# EAGLE design Motor Driver MK1 (EAGLE 6.5.0)
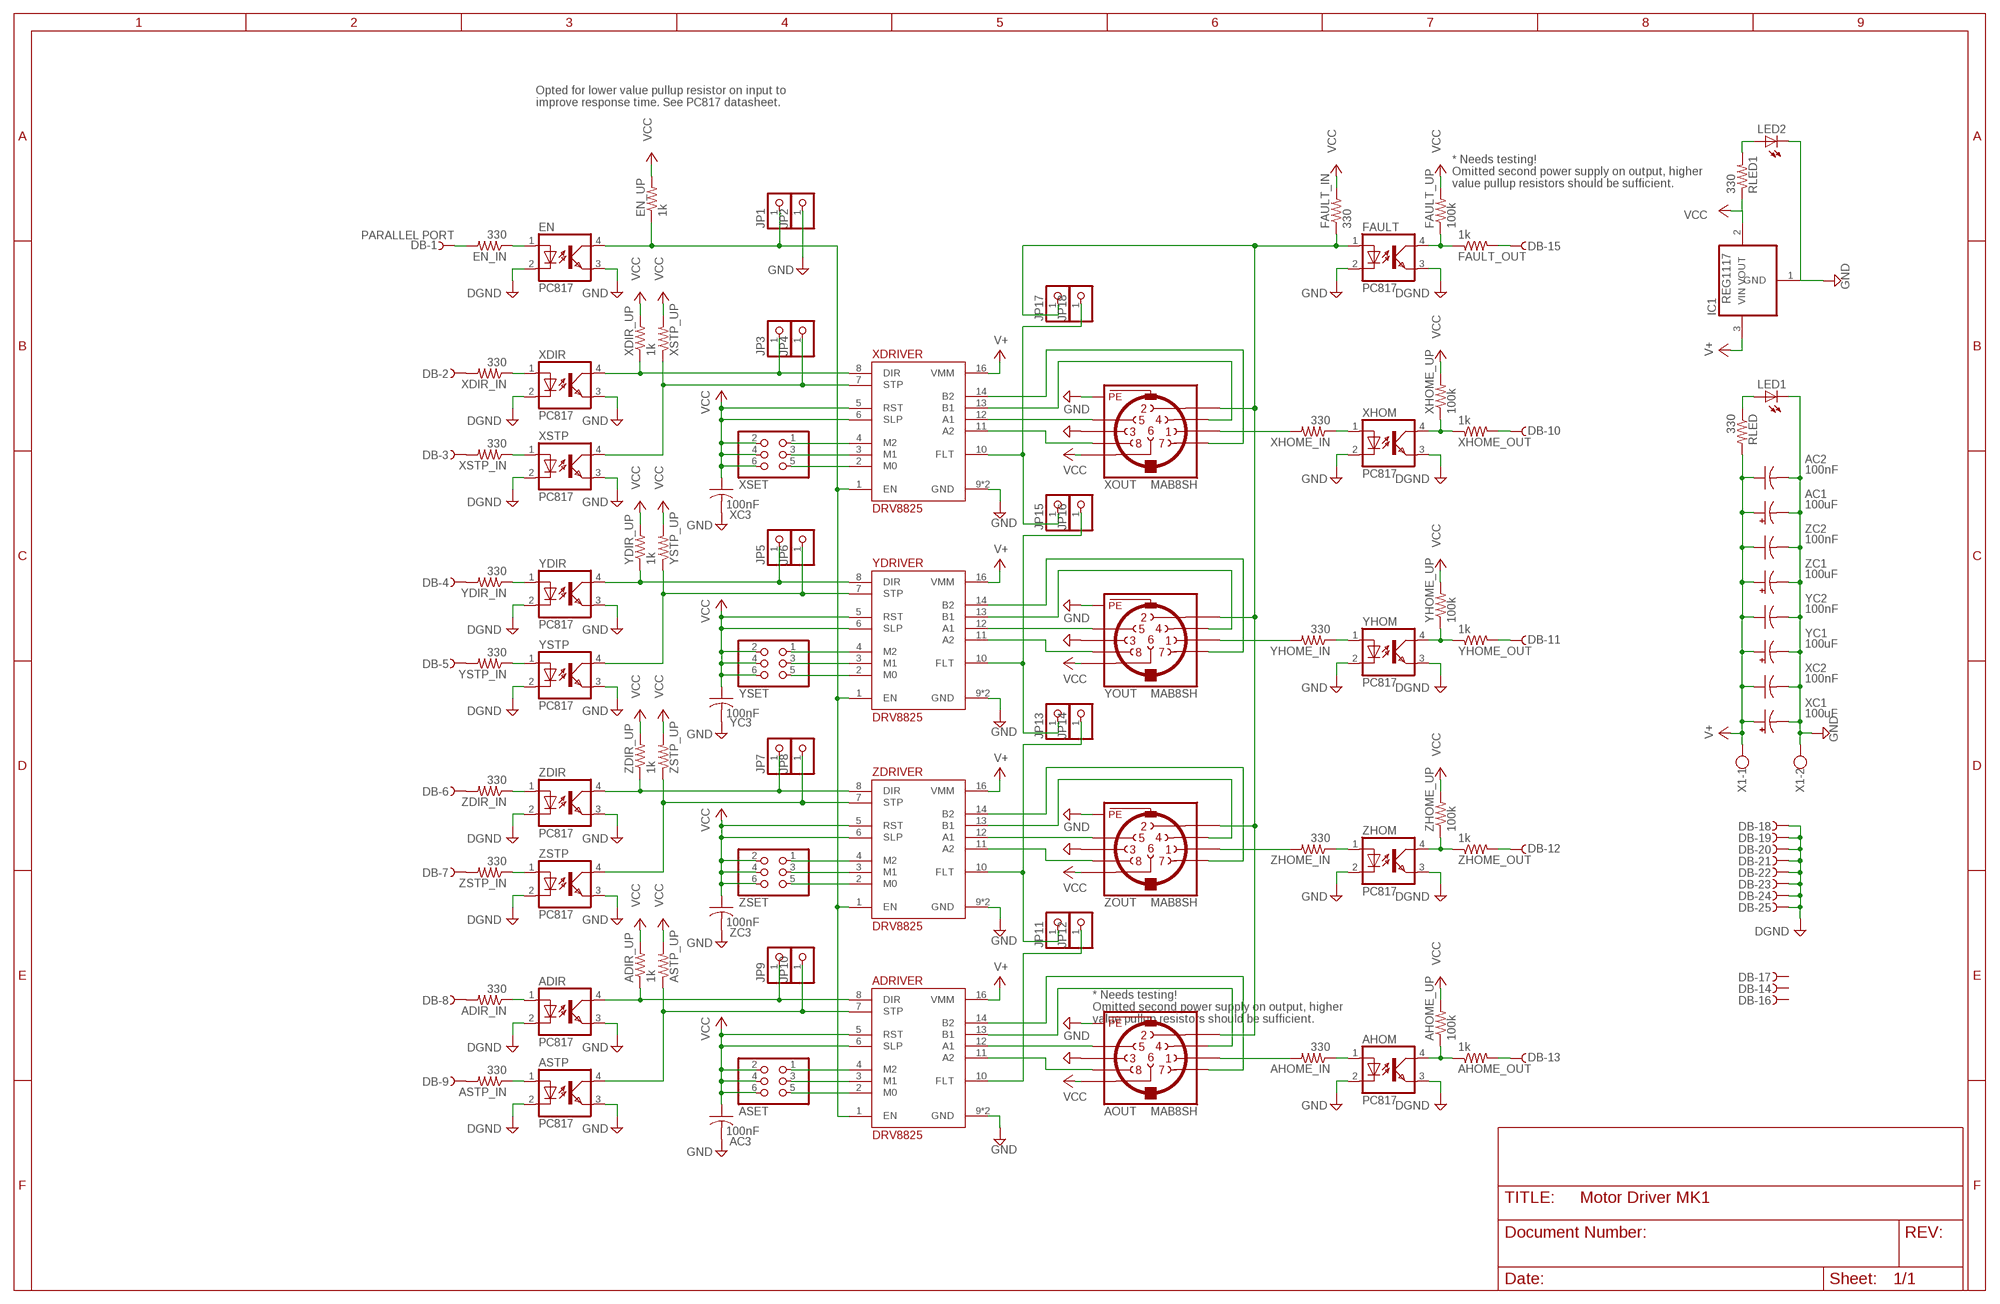
[diagram p0: schematic, sheet 1]

## Parts
AC1  100uF  CPOL-USSANYO_SMD_E7  [SANYO-OSCON_SMD_E7]
AC2  100nF  C-USC0805  [C0805]
AC3  100nF  C-USC0805  [C0805]
ADIR  PC817  [DIL04]
ADIR_IN  330  R-US_R0805  [R0805]
ADIR_UP  1k  R-US_R0805  [R0805]
ADRIVER  DRV8825  [DIP16]
AHOM  PC817  [DIL04]
AHOME_IN  330  R-US_R0805  [R0805]
AHOME_OUT  1k  R-US_R0805  [R0805]
AHOME_UP  100k  R-US_R0805  [R0805]
AOUT  MAB8SH  [MAB8SH]
ASET  PINHD-2X3  [2X03]
ASTP  PC817  [DIL04]
ASTP_IN  330  R-US_R0805  [R0805]
ASTP_UP  R-US_R0805  [R0805]
DB  PARALLEL PORT  D-SUB25-H2R25ST  [H2R25ST]
EN  PC817  [DIL04]
EN_IN  330  R-US_R0805  [R0805]
EN_UP  1k  R-US_R0805  [R0805]
FAULT  PC817  [DIL04]
FAULT_IN  330  R-US_R0805  [R0805]
FAULT_OUT  1k  R-US_R0805  [R0805]
FAULT_UP  100k  R-US_R0805  [R0805]
IC1  REG1117  [SOT223]
JP1  PINHD-1X1  [1X01]
JP2  PINHD-1X1  [1X01]
JP3  PINHD-1X1  [1X01]
JP4  PINHD-1X1  [1X01]
JP5  PINHD-1X1  [1X01]
JP6  PINHD-1X1  [1X01]
JP7  PINHD-1X1  [1X01]
JP8  PINHD-1X1  [1X01]
JP9  PINHD-1X1  [1X01]
JP10  PINHD-1X1  [1X01]
JP11  PINHD-1X1  [1X01]
JP12  PINHD-1X1  [1X01]
JP13  PINHD-1X1  [1X01]
JP14  PINHD-1X1  [1X01]
JP15  PINHD-1X1  [1X01]
JP16  PINHD-1X1  [1X01]
JP17  PINHD-1X1  [1X01]
JP18  PINHD-1X1  [1X01]
LED1  LEDCHIP-LED0805  [CHIP-LED0805]
LED2  LEDCHIP-LED0805  [CHIP-LED0805]
RLED  330  R-US_R0805  [R0805]
RLED1  330  R-US_R0805  [R0805]
X1  W237-102  [W237-102]
XC1  100uF  CPOL-USSANYO_SMD_E7  [SANYO-OSCON_SMD_E7]
XC2  100nF  C-USC0805  [C0805]
XC3  100nF  C-USC0805  [C0805]
XDIR  PC817  [DIL04]
XDIR_IN  330  R-US_R0805  [R0805]
XDIR_UP  1k  R-US_R0805  [R0805]
XDRIVER  DRV8825  [DIP16]
XHOM  PC817  [DIL04]
XHOME_IN  330  R-US_R0805  [R0805]
XHOME_OUT  1k  R-US_R0805  [R0805]
XHOME_UP  100k  R-US_R0805  [R0805]
XOUT  MAB8SH  [MAB8SH]
XSET  PINHD-2X3  [2X03]
XSTP  PC817  [DIL04]
XSTP_IN  330  R-US_R0805  [R0805]
XSTP_UP  R-US_R0805  [R0805]
YC1  100uF  CPOL-USSANYO_SMD_E7  [SANYO-OSCON_SMD_E7]
YC2  100nF  C-USC0805  [C0805]
YC3  100nF  C-USC0805  [C0805]
YDIR  PC817  [DIL04]
YDIR_IN  330  R-US_R0805  [R0805]
YDIR_UP  1k  R-US_R0805  [R0805]
YDRIVER  DRV8825  [DIP16]
YHOM  PC817  [DIL04]
YHOME_IN  330  R-US_R0805  [R0805]
YHOME_OUT  1k  R-US_R0805  [R0805]
YHOME_UP  100k  R-US_R0805  [R0805]
YOUT  MAB8SH  [MAB8SH]
YSET  PINHD-2X3  [2X03]
YSTP  PC817  [DIL04]
YSTP_IN  330  R-US_R0805  [R0805]
YSTP_UP  R-US_R0805  [R0805]
ZC1  100uF  CPOL-USSANYO_SMD_E7  [SANYO-OSCON_SMD_E7]
ZC2  100nF  C-USC0805  [C0805]
ZC3  100nF  C-USC0805  [C0805]
ZDIR  PC817  [DIL04]
ZDIR_IN  330  R-US_R0805  [R0805]
ZDIR_UP  1k  R-US_R0805  [R0805]
ZDRIVER  DRV8825  [DIP16]
ZHOM  PC817  [DIL04]
ZHOME_IN  330  R-US_R0805  [R0805]
ZHOME_OUT  1k  R-US_R0805  [R0805]
ZHOME_UP  100k  R-US_R0805  [R0805]
ZOUT  MAB8SH  [MAB8SH]
ZSET  PINHD-2X3  [2X03]
ZSTP  PC817  [DIL04]
ZSTP_IN  330  R-US_R0805  [R0805]
ZSTP_UP  R-US_R0805  [R0805]

## Nets
ASTP_UP: ADRIVER.7(STP) ASTP.4(COL) ASTP_UP.1 JP10.1
DGND: ADIR.2(C) AHOM.3(EMIT) ASTP.2(C) DB.18 DB.19 DB.20 DB.21 DB.22 DB.23 DB.24 DB.25 EN.2(C) FAULT.3(EMIT) XDIR.2(C) XHOM.3(EMIT) XSTP.2(C) YDIR.2(C) YHOM.3(EMIT) YSTP.2(C) ZDIR.2(C) ZHOM.3(EMIT) ZSTP.2(C)
GND: AC1.- AC2.2 AC3.2 ADIR.3(EMIT) ADRIVER.9(GND) ADRIVER.15(GND) AHOM.2(C) AOUT.3 AOUT.PE AOUT.PE@(PE) ASTP.3(EMIT) EN.3(EMIT) FAULT.2(C) IC1.1(GND) JP2.1 LED1.C LED2.C X1.2 XC1.- XC2.2 XC3.2 XDIR.3(EMIT) XDRIVER.9(GND) XDRIVER.15(GND) XHOM.2(C) XOUT.3 XOUT.PE XOUT.PE@(PE) XSTP.3(EMIT) YC1.- YC2.2 YC3.2 YDIR.3(EMIT) YDRIVER.9(GND) YDRIVER.15(GND) YHOM.2(C) YOUT.3 YOUT.PE YOUT.PE@(PE) YSTP.3(EMIT) ZC1.- ZC2.2 ZC3.2 ZDIR.3(EMIT) ZDRIVER.9(GND) ZDRIVER.15(GND) ZHOM.2(C) ZOUT.3 ZOUT.PE ZOUT.PE@(PE) ZSTP.3(EMIT)
N$1: XDRIVER.11(A2) XOUT.8
N$2: XDRIVER.12(A1) XOUT.5
N$3: XDRIVER.13(B1) XOUT.4
N$4: XDRIVER.14(B2) XOUT.7
N$5: ADRIVER.12(A1) AOUT.5
N$6: YDRIVER.12(A1) YOUT.5
N$7: YDRIVER.11(A2) YOUT.8
N$8: YDRIVER.13(B1) YOUT.4
N$9: YDRIVER.14(B2) YOUT.7
N$10: ZDRIVER.12(A1) ZOUT.5
N$11: ZDRIVER.11(A2) ZOUT.8
N$12: ZDRIVER.13(B1) ZOUT.4
N$13: ZDRIVER.14(B2) ZOUT.7
N$14: ADRIVER.11(A2) AOUT.8
N$15: ADRIVER.13(B1) AOUT.4
N$16: ADRIVER.14(B2) AOUT.7
N$18: JP4.1 XDRIVER.7(STP) XSTP.4(COL) XSTP_UP.1
N$19: XDRIVER.4(M2) XSET.1
N$20: XDRIVER.3(M1) XSET.3
N$21: XDRIVER.2(M0) XSET.5
N$22: YDRIVER.4(M2) YSET.1
N$23: YDRIVER.3(M1) YSET.3
N$24: YDRIVER.2(M0) YSET.5
N$25: ADRIVER.4(M2) ASET.1
N$26: ADRIVER.3(M1) ASET.3
N$27: ADRIVER.2(M0) ASET.5
N$28: ZDRIVER.4(M2) ZSET.1
N$29: ZDRIVER.3(M1) ZSET.3
N$30: ZDRIVER.2(M0) ZSET.5
N$31: LED2.A RLED1.2
N$32: AHOM.1(A) AHOME_IN.1
N$35: EN.1(A) EN_IN.1
N$36: ADRIVER.1(EN) EN.4(COL) EN_UP.1 JP1.1 XDRIVER.1(EN) YDRIVER.1(EN) ZDRIVER.1(EN)
N$37: JP11.1 JP14.1 ZDRIVER.10(FLT)
N$38: XDIR.1(A) XDIR_IN.1
N$39: XSTP.1(A) XSTP_IN.1
N$40: YDIR.1(A) YDIR_IN.1
N$41: YSTP.1(A) YSTP_IN.1
N$42: DB.3 XSTP_IN.2
N$43: DB.2 XDIR_IN.2
N$44: DB.5 YSTP_IN.2
N$45: DB.4 YDIR_IN.2
N$46: ZSTP.1(A) ZSTP_IN.1
N$47: ZDIR.1(A) ZDIR_IN.1
N$48: AHOM.4(COL) AHOME_OUT.1 AHOME_UP.1
N$49: DB.6 ZDIR_IN.2
N$50: ADIR.1(A) ADIR_IN.1
N$51: ASTP_IN.2 DB.9
N$52: ADIR_IN.2 DB.8
N$53: ASTP.1(A) ASTP_IN.1
N$54: DB.1 EN_IN.2
N$55: DB.10 XHOME_OUT.2
N$56: AOUT.2 FAULT.1(A) FAULT_IN.1 JP17.1 XOUT.2 YOUT.2 ZOUT.2
N$57: ADIR.4(COL) ADIR_UP.1 ADRIVER.8(DIR) JP9.1
N$58: FAULT.4(COL) FAULT_OUT.1 FAULT_UP.1
N$59: DB.15 FAULT_OUT.2
N$60: JP15.1 JP18.1 XDRIVER.10(FLT)
N$61: JP13.1 JP16.1 YDRIVER.10(FLT)
N$62: ADRIVER.10(FLT) JP12.1
N$64: XHOM.4(COL) XHOME_OUT.1 XHOME_UP.1
N$70: XHOM.1(A) XHOME_IN.1
N$71: YHOM.1(A) YHOME_IN.1
N$72: ZHOM.1(A) ZHOME_IN.1
N$74: DB.11 YHOME_OUT.2
N$76: LED1.A RLED.1
N$77: AHOME_OUT.2 DB.13
N$80: AHOME_IN.2 AOUT.1
N$84: DB.7 ZSTP_IN.2
N$87: YHOM.4(COL) YHOME_OUT.1 YHOME_UP.1
N$89: ZHOM.4(COL) ZHOME_OUT.1 ZHOME_UP.1
N$91: YHOME_IN.2 YOUT.1
N$92: DB.12 ZHOME_OUT.2
N$95: XHOME_IN.2 XOUT.1
N$97: ZHOME_IN.2 ZOUT.1
V+: AC1.+ AC2.1 ADRIVER.16(VMM) IC1.3(VIN) RLED.2 X1.1 XC1.+ XC2.1 XDRIVER.16(VMM) YC1.+ YC2.1 YDRIVER.16(VMM) ZC1.+ ZC2.1 ZDRIVER.16(VMM)
VCC: AC3.1 ADIR_UP.2 ADRIVER.5(RST) ADRIVER.6(SLP) AHOME_UP.2 AOUT.6 ASET.2 ASET.4 ASET.6 ASTP_UP.2 EN_UP.2 FAULT_IN.2 FAULT_UP.2 IC1.2(VOUT) RLED1.1 XC3.1 XDIR_UP.2 XDRIVER.5(RST) XDRIVER.6(SLP) XHOME_UP.2 XOUT.6 XSET.2 XSET.4 XSET.6 XSTP_UP.2 YC3.1 YDIR_UP.2 YDRIVER.5(RST) YDRIVER.6(SLP) YHOME_UP.2 YOUT.6 YSET.2 YSET.4 YSET.6 YSTP_UP.2 ZC3.1 ZDIR_UP.2 ZDRIVER.5(RST) ZDRIVER.6(SLP) ZHOME_UP.2 ZOUT.6 ZSET.2 ZSET.4 ZSET.6 ZSTP_UP.2
XSAMPLE: JP3.1 XDIR.4(COL) XDIR_UP.1 XDRIVER.8(DIR)
YDIR: JP5.1 YDIR.4(COL) YDIR_UP.1 YDRIVER.8(DIR)
YSTP: JP6.1 YDRIVER.7(STP) YSTP.4(COL) YSTP_UP.1
ZDIR: JP7.1 ZDIR.4(COL) ZDIR_UP.1 ZDRIVER.8(DIR)
ZSTP: JP8.1 ZDRIVER.7(STP) ZSTP.4(COL) ZSTP_UP.1
Unconnected: DB.14 DB.16 DB.17

## Notes on the sheet
- Opted for lower value pullup resistor on input to 
  improve response time. See PC817 datasheet.
- * Needs testing!
  Omitted second power supply on output, higher
  value pullup resistors should be sufficient.
- * Needs testing!
  Omitted second power supply on output, higher
  value pullup resistors should be sufficient.

## Library data of the parts
AC1 XC1 YC1 ZC1 = rcl:CPOL-US: POLARIZED CAPACITOR, American symbol
AC2 AC3 XC2 XC3 YC2 YC3 ZC2 ZC3 = rcl:C-US: CAPACITOR, American symbol
ADIR AHOM ASTP EN FAULT XDIR XHOM XSTP YDIR YHOM YSTP ZDIR ZHOM ZSTP = optocoupler:PC817: SHARP OPTO COUPLER; MPN: PC817X4J000F; OC_FARNELL: 9707727; OC_NEWARK: 97K7059
ADIR_IN ADIR_UP AHOME_IN AHOME_OUT AHOME_UP ASTP_IN ASTP_UP EN_IN EN_UP FAULT_IN FAULT_OUT FAULT_UP RLED RLED1 XDIR_IN XDIR_UP XHOME_IN XHOME_OUT XHOME_UP XSTP_IN XSTP_UP YDIR_IN YDIR_UP YHOME_IN YHOME_OUT YHOME_UP YSTP_IN YSTP_UP ZDIR_IN ZDIR_UP ZHOME_IN ZHOME_OUT ZHOME_UP ZSTP_IN ZSTP_UP = resistor:R-US_: RESISTOR, American symbol
ADRIVER XDRIVER YDRIVER ZDRIVER = CNC-Interface:DRV8825
AOUT XOUT YOUT ZOUT = con-hirschmann:MAB8SH: Female CONNECTOR 8 pins with shield, horizontal (DIN 41524); MF: FARNELL; MPN: MAB 8 SH; OC_FARNELL: 809913; OC_NEWARK: 67C7888
ASET XSET YSET ZSET = pinhead:PINHD-2X3: PIN HEADER
DB = con-thomas-betts:D-SUB25-: D-Subminiatur Connector Source: Electronioc Interconnects European Edition 1998; MF: TYCO ELECTRONICS; MPN: H2R25ST29J; OC_FARNELL: unknown; OC_NEWARK: 16F4224
IC1 = burr-brown:REG1117: 800mA and 1A Low Dropout (LDO) Positive Regulator 1.8V, 2.5V, 2.85V, 3.3V, 5V, and Adj; MPN: REG1117; OC_FARNELL: 1097566; OC_NEWARK: 14P6981
JP1-JP18 = pinhead:PINHD-1X1: PIN HEADER
LED1 LED2 = led:LED: LED OSRAM: - CHIPLED LG R971, LG N971, LY N971, LG Q971, LY Q971, LO R971, LY R971 LH N974, LH R974 LS Q976, LO Q976, LY Q976 LO Q996 - Hyper CHIPLED LW Q18S LB Q993, LB Q99A, LB R99A - SideLED LS A670, LO A670, LY A670, LG A670, LP A670 LB A673, LV A673, LT A673, LW A673 LH A674 LY A675 LS A676, LA A676, LO A676, LY A676, LW A676 LS A679, LY A679, LG A679 - Hyper Micro SIDELED® LS Y876, LA Y876, LO Y876, LY Y876 LT Y87S - SmartLED LW L88C, LW L88S LB L89C, LB L89S, LG L890 LS L89K, LO L89K, LY L89K LS L896, LA L896, LO L896, LY L896 - TOPLED LS T670, LO T670, LY T670, LG T670, LP T670 LSG T670, LSP T670, LSY T670, LOP T670, LYG T670 LG T671, LOG T671, LSG T671 LB T673, LV T673, LT T673, LW T673 LH T674 LS T676, LA T676, LO T676, LY T676, LB T676, LH T676, LSB T676, LW T676 LB T67C, LV T67C, LT T67C, LS T67K, LO T67K, LY T67K, LW E67C LS E67B, LA E67B, LO E67B, LY E67B, LB E67C, LV E67C, LT E67C LW T67C LS T679, LY T679, LG T679 LS T770, LO T770, LY T770, LG T770, LP T770 LB T773, LV T773, LT T773, LW T773 LH T774 LS E675, LA E675, LY E675, LS T675 LS T776, LA T776, LO T776, LY T776, LB T776 LHGB T686 LT T68C, LB T68C - Hyper Mini TOPLED® LB M676 - Mini TOPLED Santana® LG M470 LS M47K, LO M47K, LY M47K Source: http://www.osram.convergy.de LUXEON: - LUMILED® LXK2-PW12-R00, LXK2-PW12-S00, LXK2-PW14-U00, LXK2-PW14-V00 LXK2-PM12-R00, LXK2-PM12-S00, LXK2-PM14-U00 LXK2-PE12-Q00, LXK2-PE12-R00, LXK2-PE12-S00, LXK2-PE14-T00, LXK2-PE14-U00 LXK2-PB12-K00, LXK2-PB12-L00, LXK2-PB12-M00, LXK2-PB14-N00, LXK2-PB14-P00, LXK2-PB14-Q00 LXK2-PR12-L00, LXK2-PR12-M00, LXK2-PR14-Q00, LXK2-PR14-R00 LXK2-PD12-Q00, LXK2-PD12-R00, LXK2-PD12-S00 LXK2-PH12-R00, LXK2-PH12-S00 LXK2-PL12-P00, LXK2-PL12-Q00, LXK2-PL12-R00 Source: www.luxeon.com KINGBRIGHT: KA-3528ASYC Source: www.kingbright.com
X1 = con-wago-500:W237-102: WAGO SCREW CLAMP; MPN: 237-102; OC_FARNELL: unknown; OC_NEWARK: 70K9898

## Board
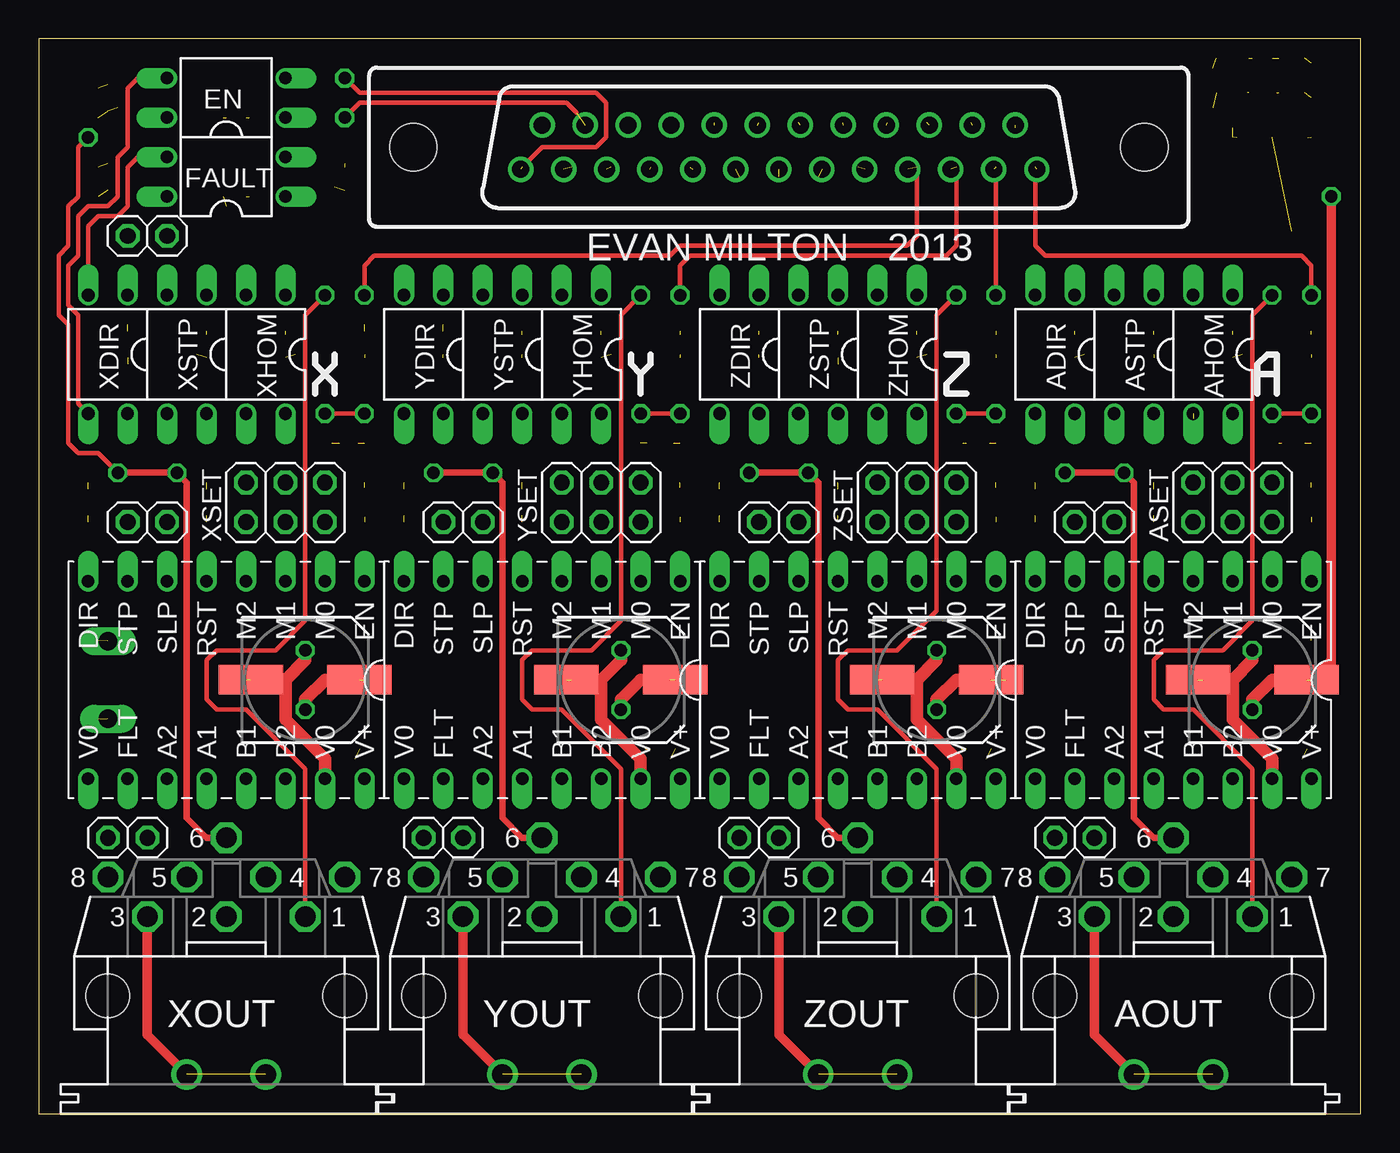
[diagram p1: board, top side]
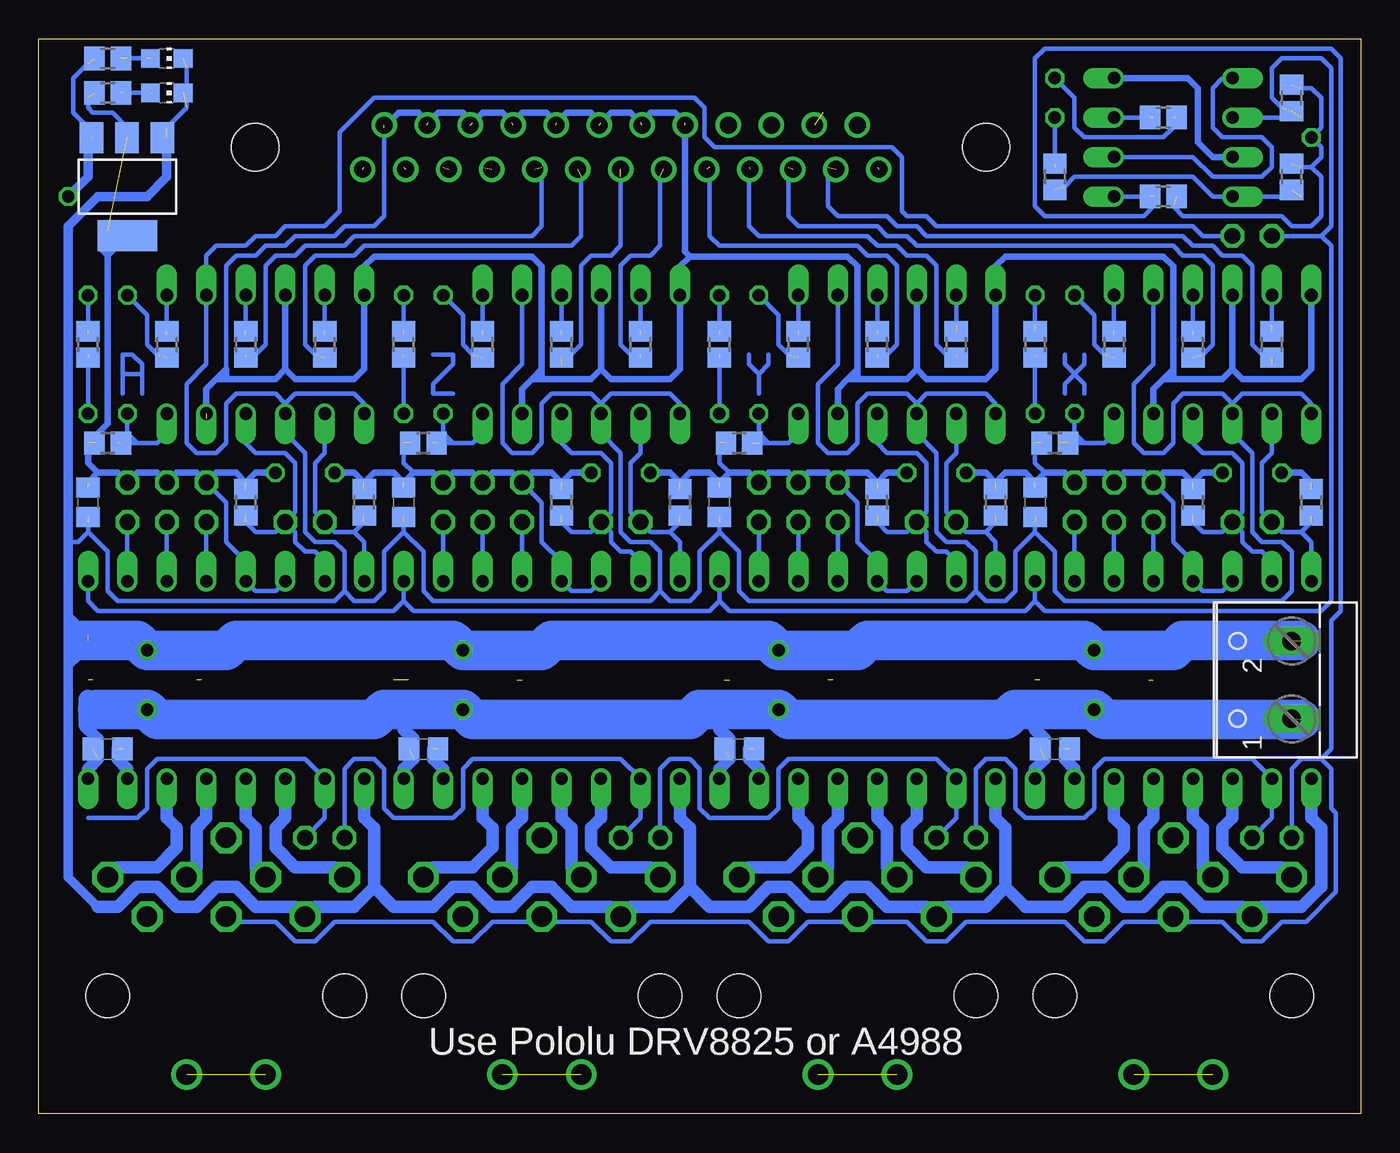
[diagram p2: board, bottom side, seen from below]

Size 85.08 x 69.2 mm. Coordinates in mm from the lower left corner, seen from the top.
Outline: 0,0 85.08,0 85.08,69.2 0,69.2 0,0
Copper layers (1*16): Top 0.035mm / dielectric 1.5mm / Bottom 0.035mm
Design rules "default *": minimum track width 10mil, minimum drill 24mil, track to track 10mil, track to pad 10mil, pad to pad 10mil, via to via 10mil, smd to smd 8mil, copper to edge 40mil, drill to drill 8mil, minimum pad ring 10mil, minimum via ring 8mil, stop-mask expansion 4mil, vias tented up to drill 0mil, thermal gap 10mil

### Footprints (pad centres in the part's own frame; a part is rotated, then mirrored left to right if it is on the bottom)
SANYO-OSCON_SMD_E7 = smd 4.15 x 1.9: + 3.5,0; - -3.5,0
C0805 = smd 1.3 x 1.5: 1 -0.95,0; 2 0.95,0
DIL04 = drill 0.813 offset: 1 -1.27,-3.81; 2 1.27,-3.81; 3 1.27,3.81; 4 -1.27,3.81
R0805 = smd 1.3 x 1.5: 1 -0.85,0; 2 0.85,0
DIP16 = drill 0.8 offset: 1 -6.35,8.89; 2 -6.35,6.35; 3 -6.35,3.81; 4 -6.35,1.27; 5 -6.35,-1.27; 6 -6.35,-3.81; 7 -6.35,-6.35; 8 -6.35,-8.89; 9 6.35,-8.89; 10 6.35,-6.35; 11 6.35,-3.81; 12 6.35,-1.27; 13 6.35,1.27; 14 6.35,3.81; 15 6.35,6.35; 16 6.35,8.89
MAB8SH = drill 1.321 octagon: 1 5.08,5.08; 2 0,5.08; 3 -5.08,5.08; 4 2.54,7.62; 5 -2.54,7.62; 6 0,10.16; 7 7.62,7.62; 8 -7.62,7.62 | drill 1.321: PE -2.54,-5.08; PE@ 2.54,-5.08 | hole 2.794: -7.62,0; 7.62,0
2X03 = drill 1.016 octagon: 1 -2.54,-1.27; 2 -2.54,1.27; 3 0,-1.27; 4 0,1.27; 5 2.54,-1.27; 6 2.54,1.27
H2R25ST = drill 1.092: 1 16.612,1.422; 2 13.843,1.422; 3 11.074,1.422; 4 8.306,1.422; 5 5.537,1.422; 6 2.769,1.422; 7 0,1.422; 8 -2.769,1.422; 9 -5.537,1.422; 10 -8.306,1.422; 11 -11.074,1.422; 12 -13.843,1.422; 13 -16.612,1.422; 14 15.227,-1.422; 15 12.459,-1.422; 16 9.69,-1.422; 17 6.921,-1.422; 18 4.153,-1.422; 19 1.384,-1.422; 20 -1.384,-1.422; 21 -4.153,-1.422; 22 -6.921,-1.422; 23 -9.69,-1.422; 24 -12.459,-1.422; 25 -15.227,-1.422 | hole 3.048: -23.52,0; 23.52,0
SOT223 = smd 1.499 x 2.007: 1 -2.261,-3.15; 2 0.025,-3.15; 3 2.311,-3.15 | smd 3.81 x 2.007: 4 0,3.15
1X01 = drill 1.016 octagon: 1 0,0
CHIP-LED0805 = smd 1.2 x 1.2: A 0,-1.05; C 0,1.05
W237-102 = drill 1.194 long: 1 -2.5,-1.27; 2 2.5,-1.27

### Placement (x,y rotation side)
AC1  78.11,27.94 0 top
AC2  80.65,23.5 0 bottom
AC3  81.92,39.37 270 bottom
ADIR  65.41,48.9 180 top
ADIR_IN  66.68,49.53 270 bottom
ADIR_UP  64.14,39.37 90 bottom
ADRIVER  73.03,27.94 270 top
AHOM  75.57,48.9 180 top
AHOME_IN  76.84,49.53 270 bottom
AHOME_OUT  81.92,49.53 90 bottom
AHOME_UP  80.65,43.18 180 bottom
AOUT  73.03,7.62 0 top
ASET  76.84,39.37 0 top
ASTP  70.48,48.9 180 top
ASTP_IN  71.76,49.53 270 bottom
ASTP_UP  71.76,39.37 90 bottom
DB  47.62,62.23 180 top
EN  12.06,65.41 90 top
EN_IN  12.7,64.14 0 bottom
EN_UP  4.45,65.41 90 bottom
FAULT  12.06,60.33 90 top
FAULT_IN  12.7,59.05 0 bottom
FAULT_OUT  19.69,60.33 90 bottom
FAULT_UP  4.45,60.33 90 bottom
IC1  79.38,59.69 180 bottom
JP1  5.71,56.52 90 top
JP2  8.26,56.52 90 top
JP3  5.71,38.1 90 top
JP4  8.26,38.1 90 top
JP5  26.04,38.1 90 top
JP6  28.58,38.1 90 top
JP7  46.35,38.1 90 top
JP8  48.89,38.1 90 top
JP9  66.68,38.1 90 top
JP10  69.22,38.1 90 top
JP11  65.41,17.78 90 top
JP12  67.95,17.78 90 top
JP13  45.09,17.78 90 top
JP14  47.62,17.78 90 top
JP15  24.77,17.78 90 top
JP16  27.31,17.78 90 top
JP17  4.45,17.78 90 top
JP18  6.98,17.78 90 top
LED1  76.84,67.94 270 bottom
LED2  76.84,65.72 270 bottom
RLED  80.65,67.94 180 bottom
RLED1  80.65,65.72 0 bottom
X1  5.71,27.94 90 bottom
XC1  17.15,27.94 0 top
XC2  19.69,23.5 0 bottom
XC3  20.96,39.37 270 bottom
XDIR  4.45,48.9 180 top
XDIR_IN  5.71,49.53 270 bottom
XDIR_UP  3.17,39.37 90 bottom
XDRIVER  12.06,27.94 270 top
XHOM  14.61,48.9 180 top
XHOME_IN  15.88,49.53 270 bottom
XHOME_OUT  20.96,49.53 90 bottom
XHOME_UP  19.69,43.18 180 bottom
XOUT  12.06,7.62 0 top
XSET  15.88,39.37 0 top
XSTP  9.53,48.9 180 top
XSTP_IN  10.79,49.53 270 bottom
XSTP_UP  10.79,39.37 90 bottom
YC1  37.46,27.94 0 top
YC2  40,23.5 0 bottom
YC3  41.27,39.37 270 bottom
YDIR  24.77,48.9 180 top
YDIR_IN  26.04,49.53 270 bottom
YDIR_UP  23.5,39.37 90 bottom
YDRIVER  32.38,27.94 270 top
YHOM  34.92,48.9 180 top
YHOME_IN  36.2,49.53 270 bottom
YHOME_OUT  41.27,49.53 90 bottom
YHOME_UP  40,43.18 180 bottom
YOUT  32.38,7.62 0 top
YSET  36.2,39.37 0 top
YSTP  29.85,48.9 180 top
YSTP_IN  31.12,49.53 270 bottom
YSTP_UP  31.12,39.37 90 bottom
ZC1  57.78,27.94 0 top
ZC2  60.32,23.5 0 bottom
ZC3  61.59,39.37 270 bottom
ZDIR  45.09,48.9 180 top
ZDIR_IN  46.35,49.53 270 bottom
ZDIR_UP  43.81,39.37 90 bottom
ZDRIVER  52.7,27.94 270 top
ZHOM  55.24,48.9 180 top
ZHOME_IN  56.52,49.53 270 bottom
ZHOME_OUT  61.59,49.53 90 bottom
ZHOME_UP  60.32,43.18 180 bottom
ZOUT  52.7,7.62 0 top
ZSET  56.52,39.37 0 top
ZSTP  50.16,48.9 180 top
ZSTP_IN  51.43,49.53 270 bottom
ZSTP_UP  51.43,39.37 90 bottom

### Tracks (layer width: path | path; a pad name or v marks a point on that pad's centre or on a via)
ASTP_UP  (1 unrouted)
  Bottom 0.305: JP10.1 69.85,37.47 71.12,37.47 71.76,38.1 | JP10.1 68.58,38.73 68.58,41.91 69.22,42.55 71.12,42.55 71.76,43.18 ASTP.4 | ADRIVER.7 66.68,35.56 67.31,36.2 67.95,36.2 68.58,36.83 68.58,37.47 JP10.1
DGND  (9 unrouted)
  Top 0.305: XDIR.2 3.17,57.15 3.81,57.78 5.08,57.78 5.71,58.42 5.71,60.96 6.35,61.59 FAULT.3
  Bottom 0.305: 62.86,63.5 62.86,57.78 63.5,57.15 65.41,57.15 66.04,56.52 68.58,56.52 69.22,55.88 70.48,55.88 71.12,55.24 72.39,55.24 73.03,54.61 73.03,47.62
  Bottom 0.406: XDIR.2 3.17,47.94 3.81,47.31 7.62,47.31 8.26,47.94 | 8.26,47.94 XSTP.2 | 8.26,47.94 8.89,47.31 12.06,47.31 | 12.06,47.31 12.7,47.31 | 12.7,47.31 13.33,46.67 XHOM.3 | 28.58,47.94 27.94,47.31 24.13,47.31 23.5,47.94 YDIR.2 23.5,54.56 22.86,55.19 12.7,55.19 12.06,54.56 12.06,47.94 12.7,47.31 | YSTP.2 28.58,47.94 | 28.58,47.94 29.21,47.31 32.38,47.31 | 32.38,47.31 33.02,47.31 | 33.02,47.31 33.66,46.67 YHOM.3 | 43.18,55.19 43.81,54.56 ZDIR.2 43.81,47.94 44.45,47.31 48.26,47.31 48.89,47.94 | 43.18,55.19 33.02,55.19 32.38,54.56 32.38,47.94 | ZSTP.2 48.89,47.94 | 48.89,47.94 49.53,47.31 52.7,47.31 | 52.7,47.31 53.34,47.31 | 53.34,47.31 53.98,46.67 ZHOM.3 | 53.34,47.31 52.7,47.94 | 52.7,47.94 52.7,54.56 53.34,55.19 63.5,55.19 64.14,54.56 ADIR.2 64.14,47.94 64.77,47.31 68.58,47.31 69.22,47.94 | ASTP.2 69.22,47.94 | 69.22,47.94 69.85,47.31 73.03,47.31 | 73.03,47.31 73.66,47.31 | 73.66,47.31 74.3,46.67 74.3,44.77 | 73.66,47.31 73.03,47.94 73.03,47.62 73.03,47.31 | 12.06,48.26 12.06,47.31 | 33.02,47.31 32.38,47.94 | 32.38,47.94 32.38,47.31 | 52.7,47.31 52.7,47.94 | FAULT.3 9.53,61.59 10.48,62.55 10.48,66.04 11.11,66.67 EN.2 | 43.18,55.19 43.5,55.51 43.5,63.82 44.13,64.45 45.72,64.45 46.35,63.82 46.99,64.45 48.26,64.45 48.89,63.82 49.53,64.45 51.12,64.45 51.75,63.82 52.39,64.45 53.98,64.45 54.61,63.82 55.24,64.45 56.52,64.45 57.15,63.82 57.78,64.45 59.37,64.45 60.01,63.82 60.64,64.45 61.91,64.45 62.86,63.5
GND  (via drill 0.8)  (22 unrouted)
  Top 0.305: EN.3 6.35,66.67 5.71,66.04 5.71,62.23 5.08,61.59 5.08,59.05 4.45,58.42 3.17,58.42 2.54,57.78 2.54,55.24 1.91,54.61 1.91,52.07 2.54,51.44 2.54,45.72 XDIR.3
  Top 0.61: YOUT.3 27.31,5.08 YOUT.PE | ZOUT.3 47.62,5.08 ZOUT.PE | AOUT.3 67.95,5.08 AOUT.PE | XOUT.3 6.98,5.08 XOUT.PE
  Top 0.813: v78.11,29.84 78.11,29.21 76.84,27.94 | 76.84,27.94 74.93,27.94 | v57.78,29.84 57.78,29.21 56.52,27.94 | 56.52,27.94 53.98,27.94 | v37.46,29.84 37.46,29.21 36.2,27.94 | 36.2,27.94 34.29,27.94 | v17.15,29.84 17.15,29.21 15.88,27.94 | 15.88,27.94 13.33,27.94 | 36.2,27.94 36.2,25.4 38.73,22.86 YDRIVER.15 | 15.88,27.94 15.88,25.4 18.42,22.86 XDRIVER.15 | 56.52,27.94 56.52,25.4 59.05,22.86 ZDRIVER.15 | 76.84,27.94 76.84,25.4 79.38,22.86 ADRIVER.15
  Bottom 0.305: YDIR.3 23.5,45.72 24.13,46.35 27.94,46.35 28.58,45.72 | ZDIR.3 43.81,45.72 44.45,46.35 48.26,46.35 48.89,45.72 | ADIR.3 64.14,45.72 64.77,46.35 68.58,46.35 69.22,45.72 | 20.96,38.1 20.96,37.47 | 20.96,37.47 22.23,36.2 22.23,33.66 22.86,33.02 24.13,33.02 24.77,33.66 | 41.27,37.47 40,36.2 40,33.66 39.37,33.02 25.4,33.02 24.77,33.66 | 41.27,38.1 41.27,37.47 | 41.27,37.47 42.54,36.2 42.54,33.66 43.18,33.02 44.45,33.02 45.09,33.66 | 61.59,37.47 60.32,36.2 60.32,33.66 59.69,33.02 45.72,33.02 45.09,33.66 | 61.59,38.1 61.59,37.47 | 61.59,37.47 62.86,36.2 62.86,33.66 63.5,33.02 64.77,33.02 65.41,33.66 | 81.92,37.47 80.65,36.2 80.65,33.66 80.01,33.02 66.04,33.02 65.41,33.66 | 81.92,37.47 81.92,38.1 | XDIR.3 3.17,45.72 3.81,46.35 7.62,46.35 8.26,45.72 | 20.96,37.47 19.69,36.2 19.69,33.66 19.05,33.02 5.08,33.02 4.45,33.66 4.45,36.2 5.08,36.83 6.35,36.83 6.98,37.47 6.98,42.55 8.26,43.81 XSTP.3 8.26,45.72 | 24.77,33.66 24.77,36.2 25.4,36.83 26.67,36.83 27.31,37.47 27.31,42.55 28.58,43.81 YSTP.3 28.58,45.72 | 45.09,33.66 45.09,36.2 45.72,36.83 46.99,36.83 47.62,37.47 47.62,42.55 48.89,43.81 ZSTP.3 48.89,45.72 | 65.41,33.66 65.41,36.2 66.04,36.83 67.31,36.83 67.95,37.47 67.95,42.55 69.22,43.81 ASTP.3 69.22,45.72 | 8.26,45.72 8.89,46.35 11.43,46.35 12.06,45.72 12.06,43.18 12.7,42.55 13.97,42.55 14.61,43.18 14.61,46.99 13.33,48.26 XHOM.2 | 28.58,45.72 29.21,46.35 31.75,46.35 32.38,45.72 32.38,43.18 33.02,42.55 34.29,42.55 34.92,43.18 34.92,46.99 33.66,48.26 YHOM.2 | 48.89,45.72 49.53,46.35 52.07,46.35 52.7,45.72 52.7,43.18 53.34,42.55 54.61,42.55 55.24,43.18 55.24,46.99 53.98,48.26 ZHOM.2
  Bottom 0.305: 69.22,45.72 69.85,46.35 72.39,46.35 73.03,45.72 73.03,43.18 73.66,42.55 74.93,42.55 75.57,43.18 75.57,46.99 74.3,48.26 AHOM.2 74.3,55.24 73.66,55.88 71.76,55.88 71.12,56.52 69.85,56.52 69.22,57.15 66.68,57.15 65.72,58.1 65.72,63.18 63.5,65.41 42.86,65.41 42.23,64.77 42.23,62.87 41.59,62.23 30.16,62.23 29.53,61.59 29.53,58.1 29.21,57.78 27.94,57.78 27.31,57.15 10.79,57.15 10.16,56.52 JP2.1 | FAULT.2 10.79,61.59 9.53,60.33 6.35,60.33 5.71,60.96 5.71,62.23 6.35,62.87 8.89,62.87 9.53,63.5 9.53,66.04 8.89,66.67 EN.3 | 81.92,37.47 82.55,36.83 83.19,36.83 | 75.57,67.31 75.57,64.77 76.84,63.5
  Bottom 0.61: 83.19,28.89 83.19,15.24 81.28,13.34 | 83.19,28.89 83.19,29.53 | 83.19,29.53 83.19,31.43 | 83.19,31.43 83.19,32.07 | 83.19,32.07 83.19,36.83 83.19,57.15 81.28,59.05 78.11,59.05 76.84,60.33 76.84,62.87 | 83.19,31.43 79.69,31.43 | 83.19,29.53 82.55,29.53 | 83.19,32.07 81.92,30.8 81.92,29.53 82.55,29.53 | 82.55,29.53 83.19,28.89
  Bottom 0.813: YDRIVER.9 23.5,19.05 22.86,18.41 22.86,14.61 | 22.86,14.61 24.13,13.34 26.67,13.34 YOUT.3 27.94,13.34 30.48,13.34 31.75,14.61 33.02,14.61 34.29,13.34 35.56,13.34 36.83,14.61 38.1,14.61 39.37,13.34 41.91,13.34 43.18,14.61 | ZDRIVER.9 43.81,19.05 43.18,18.41 43.18,14.61 | 43.18,14.61 44.45,13.34 46.99,13.34 ZOUT.3 48.26,13.34 50.8,13.34 52.07,14.61 53.34,14.61 54.61,13.34 55.88,13.34 57.15,14.61 58.42,14.61 59.69,13.34 62.23,13.34 63.5,14.61 | XDRIVER.9 3.17,19.05 2.54,18.41 2.54,14.61 3.81,13.34 6.35,13.34 XOUT.3 7.62,13.34 10.16,13.34 11.43,14.61 12.7,14.61 13.97,13.34 15.24,13.34 16.51,14.61 17.78,14.61 19.05,13.34 21.59,13.34 22.86,14.61 | ADRIVER.9 64.14,19.05 63.5,18.41 63.5,14.61 | 63.5,14.61 64.77,13.34 67.31,13.34 AOUT.3 68.58,13.34 71.12,13.34 72.39,14.61 73.66,14.61 74.93,13.34 76.2,13.34 77.47,14.61 78.74,14.61 80.01,13.34 81.28,13.34 | XDRIVER.15 18.42,22.23 19.05,22.86 19.05,23.5 | YDRIVER.15 38.73,22.23 39.37,22.86 39.37,23.5 | ZDRIVER.15 59.05,22.23 59.69,22.86 59.69,23.5 | ADRIVER.15 79.38,22.23 80.01,22.86 80.01,23.5 | 82.55,30.48 81.92,30.48
  Bottom 2.54: 3.81,30.48 11.43,30.48 12.06,29.84 v17.15,29.84 17.78,30.48 31.75,30.48 32.38,29.84 v37.46,29.84 38.1,30.48 52.07,30.48 52.7,29.84 v57.78,29.84 58.42,30.48 72.39,30.48 73.03,29.84 v78.11,29.84 78.74,30.48 81.92,30.48
N$1
  Bottom 0.813: XDRIVER.11 8.26,19.05 8.89,18.41 8.89,17.14 7.62,15.88 5.08,15.88 XOUT.8
N$2
  Bottom 0.813: XDRIVER.12 10.79,19.05 10.16,18.41 10.16,15.88 XOUT.5
N$3
  Bottom 0.813: XDRIVER.13 13.33,19.05 13.97,18.41 13.97,15.88 XOUT.4
N$4
  Bottom 0.813: XDRIVER.14 15.88,19.05 15.24,18.41 15.24,17.14 16.51,15.88 19.05,15.88 XOUT.7
N$5
  Bottom 0.813: ADRIVER.12 71.76,19.05 71.12,18.41 71.12,15.88 AOUT.5
N$6
  Bottom 0.813: YDRIVER.12 31.12,19.05 30.48,18.41 30.48,15.88 YOUT.5
N$7
  Bottom 0.813: YDRIVER.11 28.58,19.05 29.21,18.41 29.21,17.14 27.94,15.88 25.4,15.88 YOUT.8
N$8
  Bottom 0.813: YDRIVER.13 33.66,19.05 34.29,18.41 34.29,15.88 YOUT.4
N$9
  Bottom 0.813: YDRIVER.14 36.2,19.05 35.56,18.41 35.56,17.14 36.83,15.88 39.37,15.88 YOUT.7
N$10
  Bottom 0.813: ZDRIVER.12 51.43,19.05 50.8,18.41 50.8,15.88 ZOUT.5
N$11
  Bottom 0.813: ZDRIVER.11 48.89,19.05 49.53,18.41 49.53,17.14 48.26,15.88 45.72,15.88 ZOUT.8
N$12
  Bottom 0.813: ZDRIVER.13 53.98,19.05 54.61,18.41 54.61,15.88 ZOUT.4
N$13
  Bottom 0.813: ZDRIVER.14 56.52,19.05 55.88,18.41 55.88,17.14 57.15,15.88 59.69,15.88 ZOUT.7
N$14
  Bottom 0.813: ADRIVER.11 69.22,19.05 69.85,18.41 69.85,17.14 68.58,15.88 66.04,15.88 AOUT.8
N$15
  Bottom 0.813: ADRIVER.13 74.3,19.05 74.93,18.41 74.93,15.88 AOUT.4
N$16
  Bottom 0.813: ADRIVER.14 76.84,19.05 76.2,18.41 76.2,17.14 77.47,15.88 80.01,15.88 AOUT.7
N$17
  Bottom 0.61: 80.96,26.99 81.92,26.99
N$18  (1 unrouted)
  Bottom 0.305: JP4.1 8.89,37.47 10.16,37.47 10.79,38.1 | JP4.1 7.62,38.73 7.62,41.91 8.26,42.55 10.16,42.55 10.79,43.18 XSTP.4 | XDRIVER.7 5.71,35.56 6.35,36.2 6.98,36.2 7.62,36.83 7.62,37.47 JP4.1
N$19
  Bottom 0.305: XSET.1 XDRIVER.4
N$20
  Bottom 0.305: XSET.3 XDRIVER.3
N$21
  Bottom 0.305: XSET.5 XDRIVER.2
N$22
  Bottom 0.305: YSET.1 YDRIVER.4
N$23
  Bottom 0.305: YSET.3 YDRIVER.3
N$24
  Bottom 0.305: YDRIVER.2 YSET.5
N$25
  Bottom 0.305: ASET.1 ADRIVER.4
N$26
  Bottom 0.305: ASET.3 ADRIVER.3
N$27
  Bottom 0.305: ASET.5 ADRIVER.2
N$28
  Bottom 0.305: ZDRIVER.4 ZSET.1
N$29
  Bottom 0.305: ZDRIVER.3 ZSET.3
N$30
  Bottom 0.305: ZDRIVER.2 ZSET.5
N$31  (2 unrouted)
  Bottom 0.305: 77.79,65.72 79.69,65.72
N$32  (1 unrouted)
  Bottom 0.305: AHOM.1 76.84,50.16
N$33
  Bottom 1.27: 81.28,29.84 82.55,29.84
N$35  (1 unrouted)
  Bottom 0.305: EN.1 13.33,64.14
N$36  (2 unrouted)
  Bottom 0.305: 5.08,64.77 5.71,65.41 5.71,67.31 5.08,67.94 2.54,67.94 1.91,67.31 1.91,57.15 2.54,56.52 | XDRIVER.1 20.96,33.02 | 20.96,33.02 21.59,32.38 40.64,32.38 41.27,33.02 | YDRIVER.1 41.27,33.02 | 41.27,33.02 41.91,32.38 60.96,32.38 61.59,33.02 | ZDRIVER.1 61.59,33.02 | 61.59,33.02 62.23,32.38 81.28,32.38 81.92,33.02 ADRIVER.1 | 20.96,33.02 20.32,32.38 2.54,32.38 1.91,33.02 1.91,55.88 2.54,56.52 | EN.4 3.81,64.14 | JP1.1 2.54,56.52
N$37
  Bottom 0.305: JP14.1 46.35,19.05 ZDRIVER.10 47.62,22.86 57.15,22.86 57.78,22.23 57.78,19.68 58.42,19.05 62.23,19.05 62.86,19.68 62.86,22.23 63.5,22.86 64.77,22.86 65.41,22.23 JP11.1
N$38  (1 unrouted)
  Bottom 0.305: 5.71,50.8 XDIR.1
N$39  (1 unrouted)
  Bottom 0.305: XSTP.1 10.79,50.16
N$40  (1 unrouted)
  Bottom 0.305: YDIR.1 26.04,50.8
N$41  (1 unrouted)
  Bottom 0.305: YSTP.1 31.12,50.16
N$42  (2 unrouted)
  Bottom 0.305: 10.16,48.9 9.53,49.53 9.53,54.61 10.16,55.24 11.43,55.24 12.06,55.88 28.58,55.88 29.21,56.52 30.48,56.52 31.12,57.15 36.2,57.15 36.83,57.78 36.83,60.96
N$43  (2 unrouted)
  Bottom 0.305: 5.71,48.26 6.98,49.53 6.98,54.61 7.62,55.24 8.89,55.24 9.53,55.88 10.79,55.88 11.43,56.52 27.94,56.52 28.58,57.15 29.85,57.15 30.48,57.78 33.66,57.78 34.29,58.42 34.29,60.96
N$44  (2 unrouted)
  Bottom 0.305: 31.12,48.9 30.48,48.9 29.85,49.53 29.85,54.61 30.48,55.24 31.75,55.24 32.38,55.88 41.27,55.88 41.91,56.52 41.91,60.96
N$45  (2 unrouted)
  Bottom 0.305: 26.04,48.9 26.67,48.9 27.31,49.53 27.31,54.61 27.94,55.24 29.21,55.24 29.85,55.88 31.12,55.88 31.75,56.52 38.73,56.52 39.37,57.15 39.37,60.96
N$46  (1 unrouted)
  Bottom 0.305: ZSTP.1 51.43,50.16
N$47  (1 unrouted)
  Bottom 0.305: ZDIR.1 46.35,50.16
N$48  (via drill 0.8)  (2 unrouted)
  Top 0.305: v79.38,45.09 v81.92,45.09
  Bottom 0.305: AHOM.4 76.84,43.81 77.47,43.18 78.74,43.18 | 78.74,43.18 80.01,43.18 | 78.74,43.18 79.38,43.81 v79.38,45.09 | v81.92,45.09 81.92,48.9
N$49  (2 unrouted)
  Bottom 0.305: 46.35,48.9 46.99,48.9 47.62,49.53 47.62,54.61 46.99,55.24 45.72,55.24 45.09,55.88 45.09,60.33
N$50  (1 unrouted)
  Bottom 0.305: ADIR.1 66.68,50.16
N$51  (2 unrouted)
  Bottom 0.305: 71.76,48.9 71.12,48.9 70.48,49.53 70.48,54.61 69.85,55.24 68.58,55.24 67.95,55.88 65.41,55.88 64.77,56.52 53.34,56.52 52.7,57.15 52.7,60.96
N$52  (2 unrouted)
  Bottom 0.305: 67.31,48.26 67.31,48.9 67.95,49.53 67.95,54.61 67.31,55.24 64.77,55.24 64.14,55.88 50.8,55.88 50.16,56.52 50.16,60.33
N$53  (1 unrouted)
  Bottom 0.305: ASTP.1 71.76,50.16
N$54  (via drill 0.8)  (2 unrouted)
  Top 0.305: 31.12,60.96 32.38,62.23 35.88,62.23 36.51,62.87 36.51,65.09 35.88,65.72 20.64,65.72 v19.69,66.67
  Bottom 0.305: 12.06,64.14 12.06,63.5 12.7,62.87 17.78,62.87 18.42,63.5 18.42,65.41 v19.69,66.67
N$55  (via drill 0.8)  (2 unrouted)
  Top 0.305: v20.96,52.7 20.96,54.61 21.59,55.24 40.64,55.24 41.27,55.88 55.88,55.88 56.52,56.52 56.52,60.96
  Bottom 0.305: v20.96,52.7 20.96,50.8
N$56  (1 unrouted)
  Bottom 0.305: AOUT.2 72.71,12.38 69.85,12.38 68.58,11.11 67.31,11.11 66.04,12.38 59.69,12.38 58.42,11.11 57.15,11.11 55.88,12.38 53.02,12.38 ZOUT.2 52.39,12.38 49.53,12.38 48.26,11.11 46.99,11.11 45.72,12.38 39.37,12.38 38.1,11.11 36.83,11.11 35.56,12.38 32.7,12.38 YOUT.2 32.07,12.38 29.21,12.38 27.94,11.11 26.67,11.11 25.4,12.38 19.05,12.38 17.78,11.11 16.51,11.11 15.24,12.38 12.38,12.38 XOUT.2 11.75,12.38 8.89,12.38 7.62,11.11 6.35,11.11 5.08,12.38 3.49,12.38 1.59,14.29 1.59,19.37 1.91,19.68 1.91,22.23 2.54,22.86 | 2.54,22.86 3.81,22.86 4.45,22.23 JP17.1 | 2.54,22.86 1.91,23.5 1.91,31.75 1.27,32.38 1.27,67.94 1.91,68.58 20.32,68.58 20.96,67.94 20.96,58.42 20.32,57.78 13.97,57.78 13.33,58.42 13.33,59.05 FAULT.1
N$57  (1 unrouted)
  Bottom 0.305: 64.77,37.47 64.14,38.1 | ADIR.4 66.68,42.55 67.31,41.91 67.31,38.73 JP9.1 66.04,37.47 64.77,37.47 | ADRIVER.8 64.14,36.83 64.77,37.47
N$58  (2 unrouted)
  Bottom 0.305: 3.81,59.05 FAULT.4 9.53,59.05 10.79,60.33 18.42,60.33 19.05,59.69
N$59  (via drill 0.8)  (2 unrouted)
  Top 0.305: v19.69,64.14 20.64,65.09 33.97,65.09 34.61,64.45
  Bottom 0.305: 19.69,60.96 v19.69,64.14
N$60
  Bottom 0.305: JP18.1 5.71,19.05 XDRIVER.10 6.98,22.86 16.51,22.86 17.15,22.23 17.15,19.68 17.78,19.05 21.59,19.05 22.23,19.68 22.23,22.23 22.86,22.86 24.13,22.86 24.77,22.23 JP15.1
N$61
  Bottom 0.305: JP16.1 26.04,19.05 YDRIVER.10 27.31,22.86 36.83,22.86 37.46,22.23 37.46,19.68 38.1,19.05 41.91,19.05 42.54,19.68 42.54,22.23 43.18,22.86 44.45,22.86 45.09,22.23 JP13.1
N$62
  Bottom 0.305: JP12.1 66.68,19.05 ADRIVER.10 67.95,22.86 77.47,22.86 78.11,22.23 78.11,19.68 78.74,19.05 81.92,19.05
N$63
  Bottom 1.27: 81.92,31.11 82.55,31.11
N$64  (via drill 0.8)  (2 unrouted)
  Top 0.305: v18.42,45.09 v20.96,45.09
  Bottom 0.305: XHOM.4 15.88,43.81 16.51,43.18 17.78,43.18 | 17.78,43.18 19.37,43.18 | v18.42,45.09 18.42,43.81 17.78,43.18 | v20.96,45.09 20.96,48.9
N$65
  Bottom 0.305: 17.78,48.9 17.78,48.26 19.05,46.99 19.05,46.35
N$68
  Bottom 0.305: 17.78,46.35 17.78,46.99 19.05,48.26 19.05,48.9
N$69
  Bottom 0.305: 38.1,48.9 38.1,48.26 38.73,47.62 | 39.37,48.9 39.37,48.26 38.73,47.62 | 38.73,47.62 38.73,46.35
N$70  (1 unrouted)
  Bottom 0.305: XHOM.1 15.88,50.16
N$71  (1 unrouted)
  Bottom 0.305: YHOM.1 36.2,50.16
N$72  (1 unrouted)
  Bottom 0.305: ZHOM.1 56.52,50.16
N$73
  Bottom 0.305: 59.69,48.9 58.42,48.9 58.42,48.26 59.69,46.99 59.69,46.35 58.42,46.35
N$74  (via drill 0.8)  (2 unrouted)
  Top 0.305: v41.27,52.7 41.27,54.61 41.91,55.24 58.42,55.24 59.05,55.88 59.05,60.96
  Bottom 0.305: v41.27,52.7 41.27,50.16
N$75
  Bottom 0.305: 78.42,46.35 78.42,47.62 | 78.42,47.62 78.42,48.26 79.06,48.9 79.69,48.9 79.69,47.62 | 79.69,47.62 79.69,46.35 | 78.42,47.62 79.69,47.62
N$76  (2 unrouted)
  Bottom 0.305: 78.11,67.94 79.38,67.94
N$77  (via drill 0.8)  (2 unrouted)
  Top 0.305: 64.14,60.96 64.14,55.88 64.77,55.24 81.28,55.24 81.92,54.61 v81.92,52.7
  Bottom 0.305: v81.92,52.7 81.92,50.16
N$80  (via drill 0.8)  (1 unrouted)
  Top 0.305: AOUT.1 78.11,22.23 74.3,26.04 72.39,26.04 71.76,26.67 71.76,29.21 72.39,29.84 76.2,29.84 78.11,31.75 78.11,51.44 v79.38,52.7
  Bottom 0.305: v79.38,52.7 78.11,51.44 78.11,49.53 77.47,48.9
N$84  (2 unrouted)
  Bottom 0.305: 51.43,48.26 50.16,49.53 50.16,54.61 49.53,55.24 48.26,55.24 47.62,55.88 47.62,60.33
N$87  (via drill 0.8)  (2 unrouted)
  Top 0.305: v38.73,45.09 v41.27,45.09
  Bottom 0.305: YHOM.4 36.2,43.81 36.83,43.18 38.1,43.18 | 38.1,43.18 38.73,43.18 | v38.73,45.09 38.73,43.81 38.1,43.18 | v41.27,45.09 41.27,48.9
N$89  (via drill 0.8)  (2 unrouted)
  Top 0.305: v59.05,45.09 v61.59,45.09
  Bottom 0.305: ZHOM.4 56.52,43.81 57.15,43.18 58.42,43.18 | 58.42,43.18 59.69,43.18 | v59.05,45.09 59.05,43.81 58.42,43.18 | v61.59,45.09 61.59,48.9
N$91  (via drill 0.8)  (1 unrouted)
  Top 0.305: YOUT.1 37.46,22.23 33.66,26.04 31.75,26.04 31.12,26.67 31.12,29.21 31.75,29.84 35.56,29.84 37.46,31.75 37.46,51.44 v38.73,52.7
  Bottom 0.305: v38.73,52.7 37.46,51.44 37.46,49.53 36.83,48.9
N$92  (via drill 0.8)  (2 unrouted)
  Top 0.305: 61.59,60.96 v61.59,52.7
  Bottom 0.305: v61.59,52.7 61.59,50.16
N$95  (via drill 0.8)  (1 unrouted)
  Top 0.305: XOUT.1 17.15,22.23 13.33,26.04 11.43,26.04 10.79,26.67 10.79,29.21 11.43,29.84 15.24,29.84 17.15,31.75 17.15,51.44 v18.42,52.7
  Bottom 0.305: v18.42,52.7 17.15,51.44 17.15,49.53 16.51,48.9
N$97  (via drill 0.8)  (1 unrouted)
  Top 0.305: ZOUT.1 57.78,22.23 53.98,26.04 52.07,26.04 51.43,26.67 51.43,29.21 52.07,29.84 55.24,29.84 57.78,32.38 57.78,51.44 v59.05,52.7
  Bottom 0.305: v59.05,52.7 57.78,51.44 57.78,49.53 57.15,48.9
V+  (via drill 0.8)  (11 unrouted)
  Top 0.61: 79.38,27.94 81.92,27.94 83.19,29.21 | 83.19,27.94 83.19,29.21 | 83.19,29.21 v83.19,59.05
  Top 0.813: v78.11,26.04 78.11,26.67 79.38,27.94 80.65,27.94 | v57.78,26.04 57.78,26.67 59.05,27.94 62.23,27.94 | v37.46,26.04 37.46,26.67 38.73,27.94 40.64,27.94 | v17.15,26.04 17.15,26.67 18.42,27.94 20.96,27.94
  Bottom 0.305: 81.92,62.87 81.92,63.5 82.87,64.45 82.87,66.67 81.92,67.63
  Bottom 0.61: v83.19,59.05 81.92,60.33 81.92,62.87
  Bottom 0.813: XDRIVER.16 20.96,22.23 20.32,22.86 20.32,24.13 20.96,24.77 20.96,26.04 | YDRIVER.16 41.27,22.23 40.64,22.86 40.64,24.13 41.27,24.77 41.27,26.04 | ZDRIVER.16 61.59,22.23 60.96,22.86 60.96,24.13 61.59,24.77 61.59,26.04 | ADRIVER.16 81.92,22.23 81.28,22.86 81.28,24.13 81.92,24.77 81.92,25.08 | 81.92,25.72 81.92,26.04 81.28,26.04
  Bottom 1.27: 81.92,26.67 81.92,25.72 81.92,25.08
  Bottom 2.54: 3.81,25.4 16.51,25.4 v17.15,26.04 20.96,26.04 22.23,26.04 22.86,25.4 36.83,25.4 v37.46,26.04 41.27,26.04 42.54,26.04 43.18,25.4 57.15,25.4 v57.78,26.04 61.59,26.04 62.86,26.04 63.5,25.4 77.47,25.4 v78.11,26.04 81.28,26.04
VCC  (via drill 0.8)  (22 unrouted)
  Top 0.305: v3.17,62.87 2.54,62.23 2.54,59.05 1.91,58.42 1.91,55.88 1.27,55.24 1.27,51.44 1.91,50.8 1.91,43.18 2.54,42.55 3.81,42.55 v5.08,41.27
  Top 0.406: v5.08,41.27 v8.89,41.27 9.53,40.64 9.53,19.05 10.79,17.78 XOUT.6 | v25.4,41.27 v29.21,41.27 29.85,40.64 29.85,19.05 31.12,17.78 YOUT.6 | v45.72,41.27 v49.53,41.27 50.16,40.64 50.16,19.05 51.43,17.78 ZOUT.6 | v66.04,41.27 v69.85,41.27 70.48,40.64 70.48,19.05 71.76,17.78 AOUT.6
  Bottom 0.305: YDRIVER.6 29.21,33.66 30.48,33.66 YDRIVER.5 31.12,35.56 32.38,36.83 32.38,39.37 YSET.2 | ZDRIVER.6 49.53,33.66 50.8,33.66 ZDRIVER.5 51.43,35.56 52.7,36.83 52.7,39.37 ZSET.2 | ADRIVER.6 69.85,33.66 71.12,33.66 ADRIVER.5 71.76,35.56 73.03,36.83 73.03,39.37 ASET.2 | XSET.2 12.06,39.37 12.06,36.83 10.79,35.56 XDRIVER.5 10.16,33.66 8.89,33.66 XDRIVER.6 | 3.81,66.04 3.17,66.04 2.54,65.41 2.54,63.5 v3.17,62.87 2.54,62.23 2.54,61.59 3.17,60.96 | 3.17,60.96 3.81,60.96 | 12.06,58.42 11.43,57.78 5.08,57.78 4.45,57.15 3.17,57.15 2.54,57.78 2.54,60.33 3.17,60.96 | 20.32,41.27 20.96,41.91 20.96,43.18 | 40.64,41.27 41.27,41.91 41.27,43.18 | 60.96,41.27 61.59,41.91 61.59,43.18 | 79.38,62.87 79.38,63.5 80.33,64.45 81.6,64.45 81.92,64.77 81.92,65.41
  Bottom 0.406: v8.89,41.27 10.16,41.27 10.79,40.64 11.43,41.27 12.7,41.27 XSET.2 13.97,41.27 15.24,41.27 XSET.4 16.51,41.27 17.78,41.27 XSET.6 19.05,41.27 20.32,41.27 20.96,40.64 21.59,41.27 22.86,41.27 23.5,40.64 24.13,41.27 v25.4,41.27 | v29.21,41.27 30.48,41.27 31.12,40.64 31.75,41.27 33.02,41.27 YSET.2 34.29,41.27 35.56,41.27 YSET.4 36.83,41.27 38.1,41.27 YSET.6 39.37,41.27 40.64,41.27 41.27,40.64 41.91,41.27 43.18,41.27 43.81,40.64 44.45,41.27 v45.72,41.27 | v49.53,41.27 50.8,41.27 51.43,40.64 52.07,41.27 53.34,41.27 ZSET.2 54.61,41.27 55.88,41.27 ZSET.4 57.15,41.27 58.42,41.27 ZSET.6 59.69,41.27 60.96,41.27 61.59,40.64 62.23,41.27 63.5,41.27 64.14,40.64 64.77,41.27 v66.04,41.27 | v69.85,41.27 71.12,41.27 71.76,40.64 72.39,41.27 73.66,41.27 ASET.2 74.93,41.27 76.2,41.27 ASET.4 77.47,41.27 78.74,41.27 ASET.6 80.01,41.27 81.28,41.27 | 81.28,41.27 81.92,40.64 | v5.08,41.27 3.81,41.27 3.17,40.64 | 80.65,56.83 80.65,55.24 | 80.65,55.24 80.65,44.45 81.92,43.18 81.92,41.91 81.28,41.27 | 80.65,55.24 80.96,55.56 80.96,56.2 | 80.65,55.24 80.01,55.88
XSAMPLE  (1 unrouted)
  Bottom 0.305: 3.81,37.47 3.17,38.1 | XDIR.4 5.71,42.55 6.35,41.91 6.35,38.73 JP3.1 5.08,37.47 3.81,37.47 | XDRIVER.8 3.17,36.83 3.81,37.47
YDIR  (1 unrouted)
  Bottom 0.305: 24.13,37.47 23.5,38.1 | YDIR.4 26.04,42.55 26.67,41.91 26.67,38.73 JP5.1 25.4,37.47 24.13,37.47 | YDRIVER.8 23.5,36.83 24.13,37.47
YSTP  (1 unrouted)
  Bottom 0.305: JP6.1 29.21,37.47 30.48,37.47 31.12,38.1 | JP6.1 27.94,38.73 27.94,41.91 28.58,42.55 30.48,42.55 31.12,43.18 YSTP.4 | YDRIVER.7 26.04,35.56 26.67,36.2 27.31,36.2 27.94,36.83 27.94,37.47 JP6.1
ZDIR  (1 unrouted)
  Bottom 0.305: 44.45,37.47 43.81,38.1 | ZDIR.4 46.35,42.55 46.99,41.91 46.99,38.73 JP7.1 45.72,37.47 44.45,37.47 | ZDRIVER.8 43.81,36.83 44.45,37.47
ZSTP  (1 unrouted)
  Bottom 0.305: JP8.1 49.53,37.47 50.8,37.47 51.43,38.1 | JP8.1 48.26,38.73 48.26,41.91 48.89,42.55 50.8,42.55 51.43,43.18 ZSTP.4 | ZDRIVER.7 46.35,35.56 46.99,36.2 47.62,36.2 48.26,36.83 48.26,37.47 JP8.1

### Text on the board
tNames: EVAN MILTON | 2013
bNames: Use Pololu DRV8825 or A4988